# EAGLE design piZero_node_new (EAGLE 7.6.0)
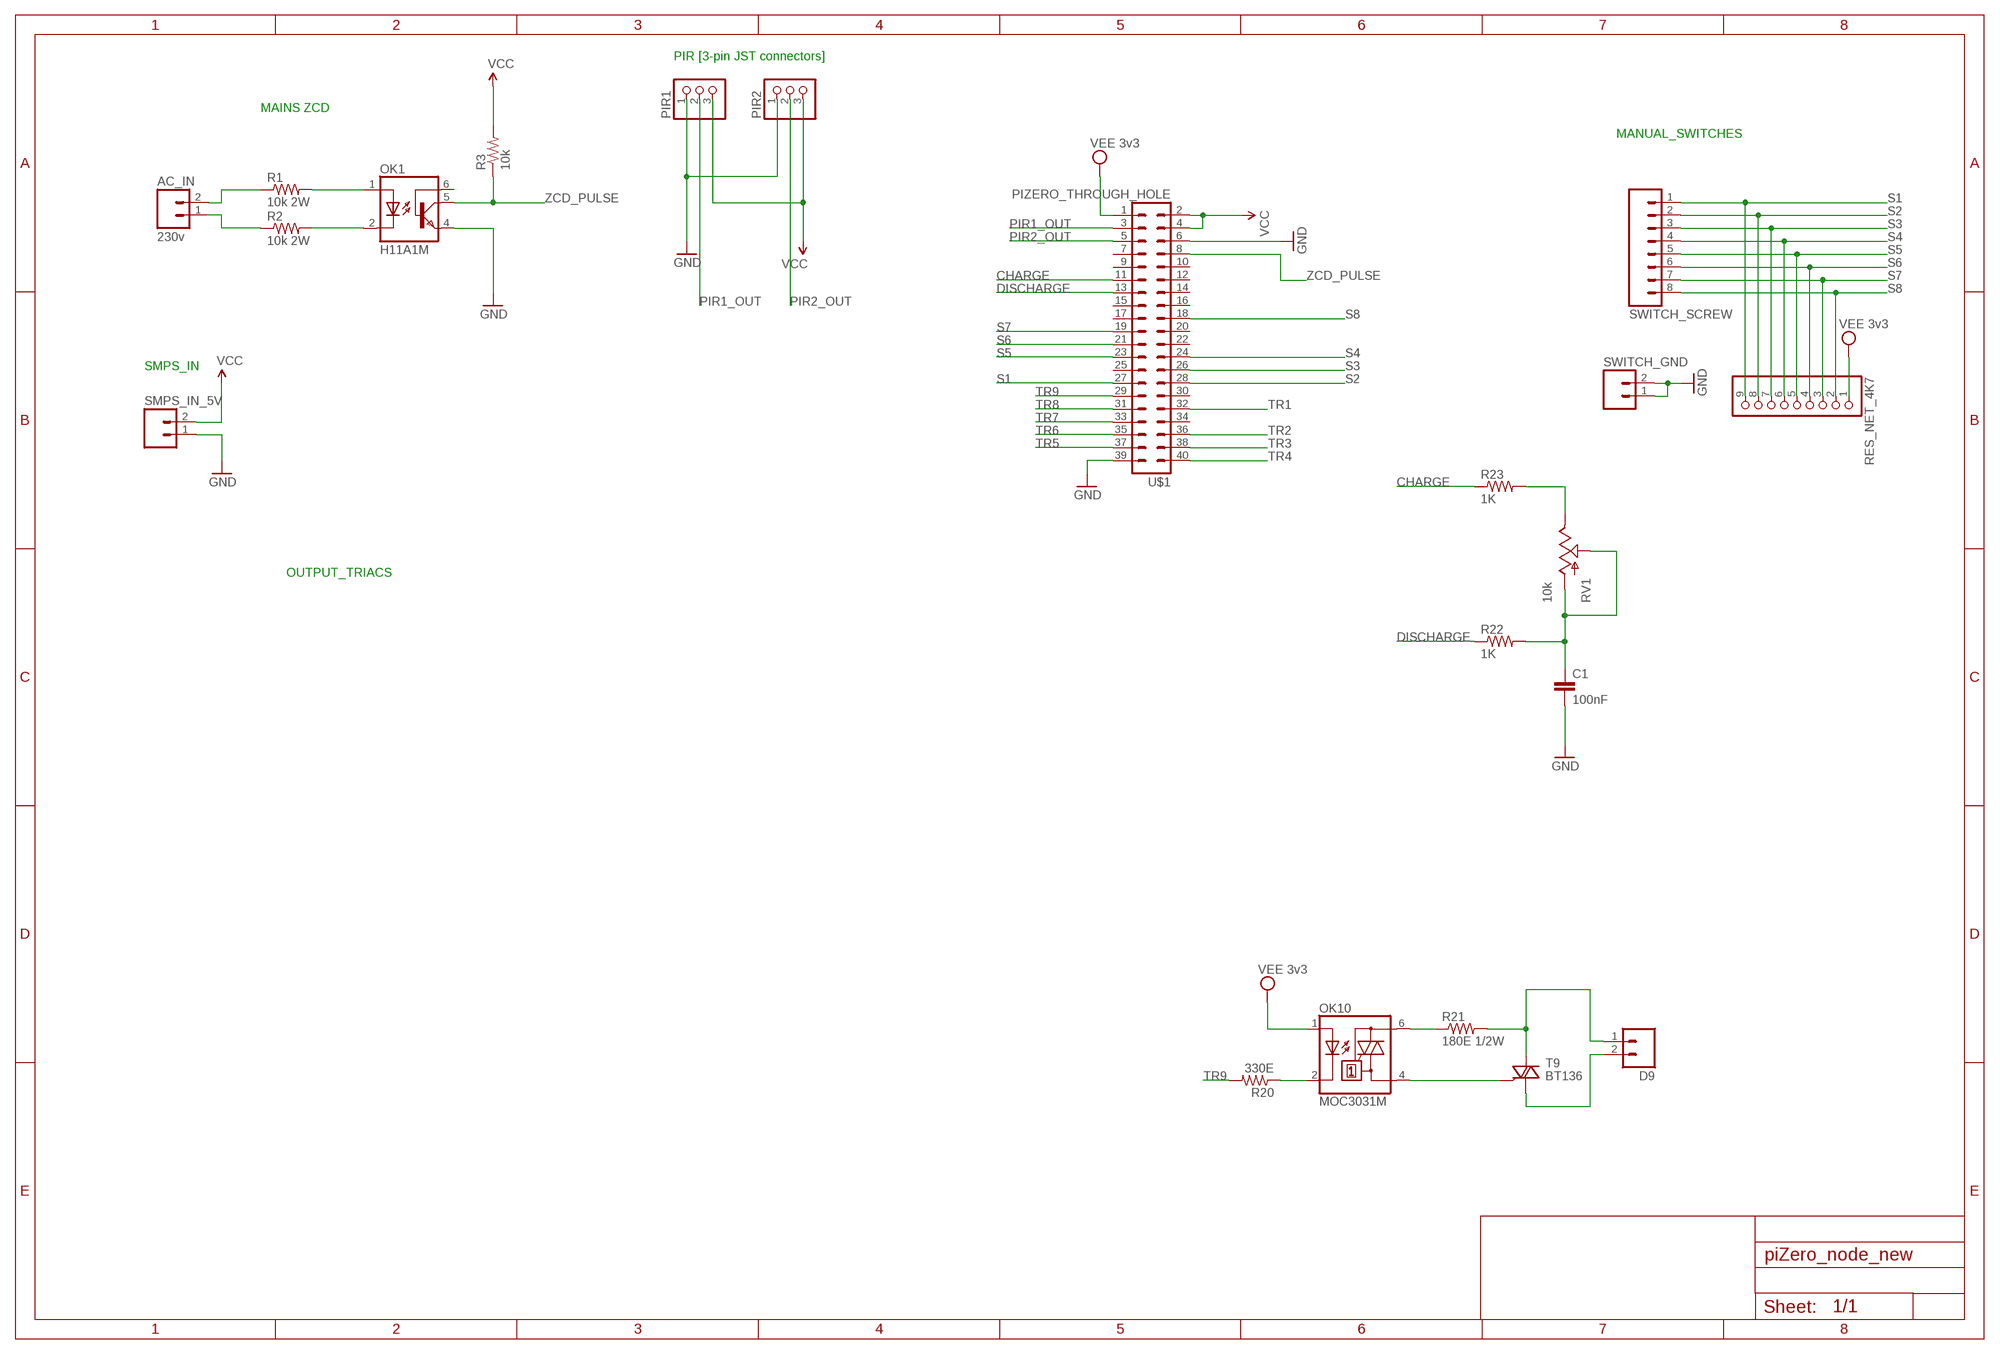
[diagram p0: schematic, sheet 1]

## Parts
AC_IN  230v  M023.5MM_LOCK  [SCREWTERMINAL-3.5MM-2_LOCK]
C1  100nF  C-EU025-025X050  [C025-025X050]
D9  M023.5MM_LOCK  [SCREWTERMINAL-3.5MM-2_LOCK]
OK1  H11A1M  [DIL06]
OK10  MOC3031M  [DIL06]
PIR1  PINHD-1X3  [1X03]
PIR2  PINHD-1X3  [1X03]
R1  10k 2W  RESISTORPTH-2W  [AXIAL-0.8]
R2  10k 2W  RESISTORPTH-2W  [AXIAL-0.8]
R3  10k  RESISTORPTH-1/4W  [AXIAL-0.4]
R20  330E  RESISTORPTH-1/4W  [AXIAL-0.4]
R21  180E 1/2W  RESISTORPTH-1/2W  [AXIAL-0.5]
R22  1K  RESISTORPTH-1/4W  [AXIAL-0.4]
R23  1K  RESISTORPTH-1/4W  [AXIAL-0.4]
RES_NET_4K7  PINHD-1X9  [1X09]
RV1  10k  POT-RV16AF-20  [POT_ALPHA_RV16AF-20]
SMPS_IN_5V  M023.5MM_LOCK  [SCREWTERMINAL-3.5MM-2_LOCK]
SWITCH_GND  M023.5MM  [SCREWTERMINAL-3.5MM-2]
SWITCH_SCREW  M083.5MM-8  [SCREWTERMINAL-3.5MM-8]
T9  BT136  [TO220AB]
U$1  PIZERO_THROUGH_HOLE  [PIZERO_THOUGH_HOLE]

## Nets
CHARGE: R23.P$1 U$1.11
DISCHARGE: R22.P$1 U$1.13
GND: C1.2 OK1.4(EMI) PIR1.1 PIR2.1 SMPS_IN_5V.1 SWITCH_GND.1 SWITCH_GND.2 U$1.6 U$1.39
N$1: AC_IN.2 R1.P$1
N$2: AC_IN.1 R2.P$1
N$3: OK1.1(A) R1.P$2
N$4: OK1.2(C) R2.P$2
N$45: OK10.6(A2) R21.P$1
N$46: D9.1 R21.P$2 T9.2(A2)
N$47: OK10.4(A1) T9.3(G)
N$48: D9.2 T9.1(A1)
N$49: OK10.2(C) R20.P$1
N$50: C1.1 R22.P$2 RV1.1(A) RV1.2(S)
N$52: R23.P$2 RV1.3(E)
PIR1_OUT: PIR1.2 U$1.3
PIR2_OUT: PIR2.2 U$1.5
S1: RES_NET_4K7.9 SWITCH_SCREW.1 U$1.27
S2: RES_NET_4K7.8 SWITCH_SCREW.2 U$1.28
S3: RES_NET_4K7.7 SWITCH_SCREW.3 U$1.26
S4: RES_NET_4K7.6 SWITCH_SCREW.4 U$1.24
S5: RES_NET_4K7.5 SWITCH_SCREW.5 U$1.23
S6: RES_NET_4K7.4 SWITCH_SCREW.6 U$1.21
S7: RES_NET_4K7.3 SWITCH_SCREW.7 U$1.19
S8: RES_NET_4K7.2 SWITCH_SCREW.8 U$1.18
TR1: U$1.32
TR2: U$1.36
TR3: U$1.38
TR4: U$1.40
TR5: U$1.37
TR6: U$1.35
TR7: U$1.33
TR8: U$1.31
TR9: R20.P$2 U$1.29
VCC: PIR1.3 PIR2.3 R3.P$2 SMPS_IN_5V.2 U$1.2 U$1.4
VEE: OK10.1(A) RES_NET_4K7.1 U$1.1 ; supply symbol labelled VEE 3v3
ZCD_PULSE: OK1.5(COL) R3.P$1 U$1.8
Unconnected: OK1.6(BAS) U$1.7 U$1.9 U$1.10 U$1.12 U$1.14 U$1.15 U$1.16 U$1.17 U$1.20 U$1.22 U$1.25 U$1.30 U$1.34

## Notes on the sheet
- PIR [3-pin JST connectors]
- MAINS ZCD
- MANUAL_SWITCHES
- SMPS_IN
- OUTPUT_TRIACS

## Library data of the parts
AC_IN D9 SMPS_IN_5V SWITCH_GND = SparkFun-Connectors:M02: Standard 2-pin 0.1" header. Use with - straight break away headers ( PRT-00116) - right angle break away headers (PRT-00553) - swiss pins (PRT-00743) - machine pins (PRT-00117) - female headers (PRT-00115) Molex polarized connector foot print use with: PRT-08233 with associated crimp pins and housings. 2.54_SCREWTERM for use with PRT-10571. 3.5mm Screw Terminal footprints for PRT-08084 5mm Screw Terminal footprints for use with PRT-08432; PROD_ID: CONN-08399
C1 = resistor:C-EU: CAPACITOR, European symbol
OK1 = optocoupler:H11A*?M: General Purpose 6-Pin Phototransistor Optocouplers Source: http://www.fairchildsemi.com/ds/4N/4N35-M.pdf; MPN: H11A1-M; OC_FARNELL: 1021358; OC_NEWARK: 97K1793
OK10 = optocoupler:MOC30*: 6-Pin DIP Zero-Cross Optoisolators Triac Driver Output (250/400 Volt Peak) Source: Data sheet <http://www.fairchildsemi.com/ds/MO/MOC3031M.pdf> The old path of data sheet not more available 2013-05-06.; MF: FAIRCHILD SEMICONDUCTOR; MPN: MOC3031M; OC_FARNELL: 9875964; OC_NEWARK: 78K6089
PIR1 PIR2 = pinhead:PINHD-1X3: PIN HEADER
R1-R3 R20-R23 = SparkFun-Passives:RESISTOR: Resistor Basic schematic elements and footprints for 0603, 1206, and PTH resistors.
RES_NET_4K7 = pinhead:PINHD-1X9: PIN HEADER
RV1 = SparkFun-Electromechanical:POT
SWITCH_SCREW = SparkFun-Connectors:M08: Header 8 Standard 8-pin 0.1" header. Use with straight break away headers (SKU : PRT-00116), right angle break away headers (PRT-00553), swiss pins (PRT-00743), machine pins (PRT-00117), and female headers (PRT-00115).
T9 = triac:BT136: Triac BT136 series E sensitive gate Source: http://www.nxp.com/acrobat_download/datasheets/BT136_SERIES_E_2.pdf
U$1 = pizero:PIZERO_THROUGH_HOLE

## Board
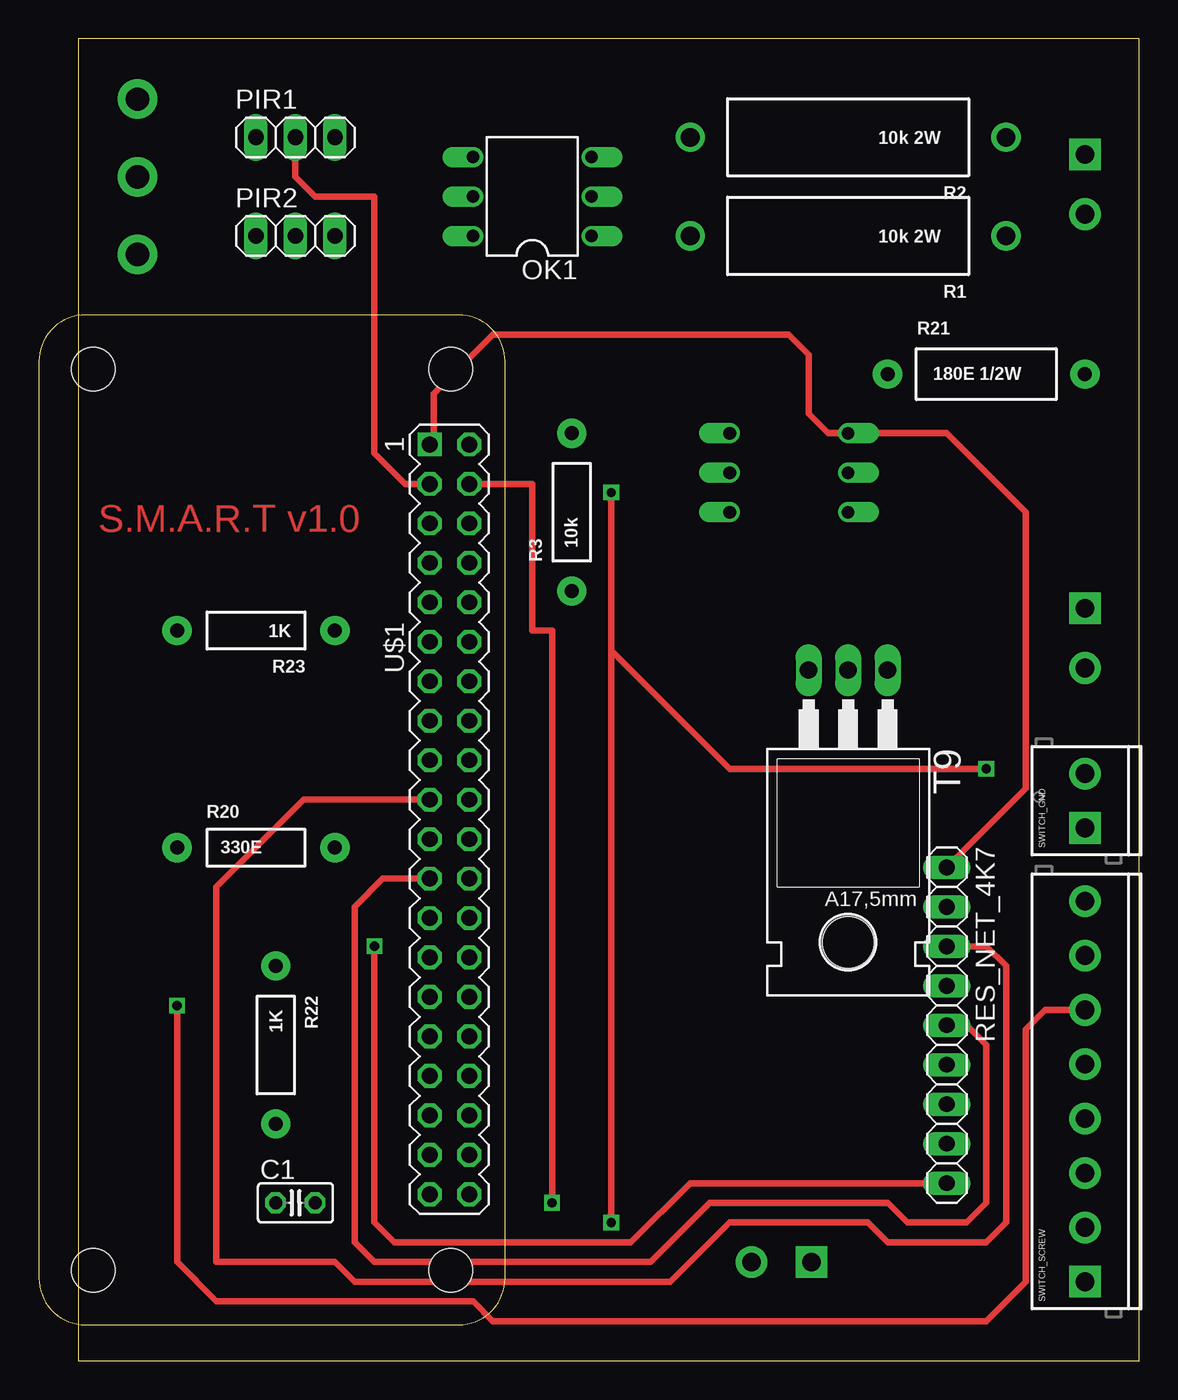
[diagram p1: board, top side]
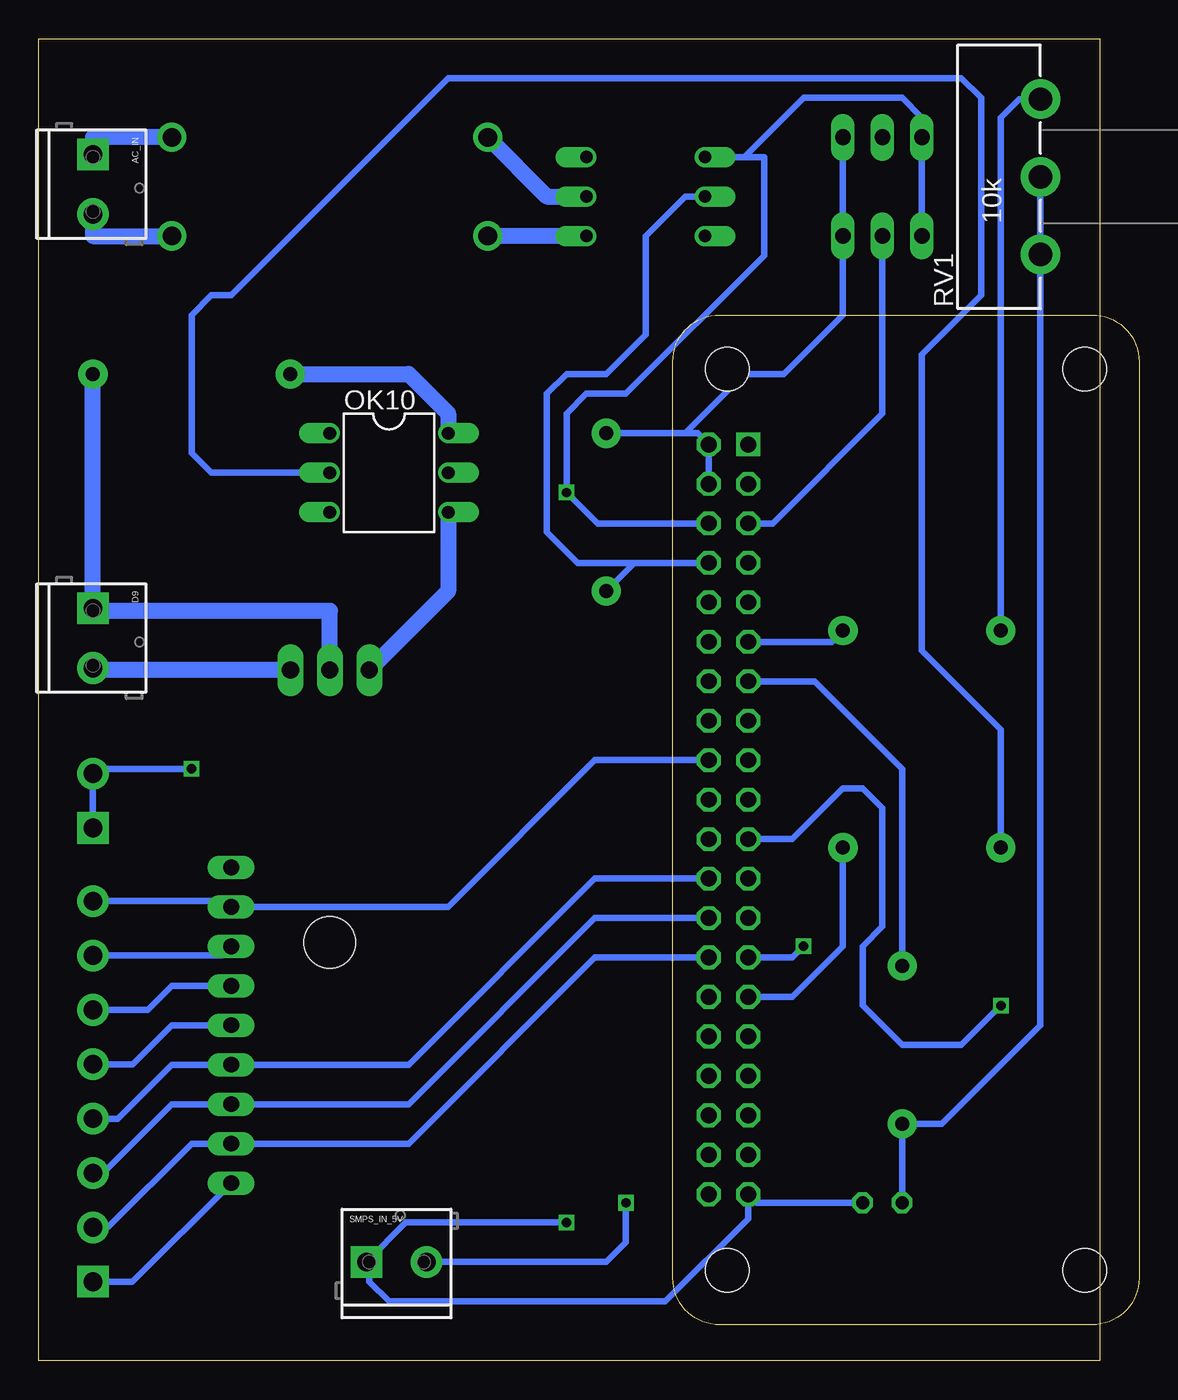
[diagram p2: board, bottom side, seen from below]

Size 68.25 x 85.08 mm. Coordinates in mm from the lower left corner, seen from the top.
Outline: 0,0 68.25,0 68.25,85.08 0,85.08 0,0
Copper layers (1*16): Top 0.035mm / dielectric 1.5mm / Bottom 0.035mm
Design rules "default": minimum track width 10mil, minimum drill 24mil, track to track 8mil, track to pad 8mil, pad to pad 8mil, via to via 8mil, smd to smd 8mil, copper to edge 40mil, drill to drill 8mil, minimum pad ring 10mil, minimum via ring 8mil, stop-mask expansion 4mil, vias tented up to drill 0mil, thermal gap 10mil

### Footprints (pad centres in the part's own frame; a part is rotated, then mirrored left to right if it is on the bottom)
SCREWTERMINAL-3.5MM-2_LOCK = drill 1.2 pad 2.032 square: 1 -0.178,0 | drill 1.2 pad 2.032: 2 3.678,0
C025-025X050 = drill 0.813 octagon: 1 -1.27,0; 2 1.27,0
DIL06 = drill 0.813 offset: 1 -2.54,-3.81; 2 0,-3.81; 3 2.54,-3.81; 4 2.54,3.81; 5 0,3.81; 6 -2.54,3.81
1X03 = drill 1.016 long: 1 -2.54,0; 2 0,0; 3 2.54,0
AXIAL-0.8 = drill 1.2 pad 1.88: P$1 -10.16,0; P$2 10.16,0
AXIAL-0.4 = drill 0.9 pad 1.88: P$1 -5.08,0; P$2 5.08,0
AXIAL-0.5 = drill 0.9 pad 1.88: P$1 -6.35,0; P$2 6.35,0
1X09 = drill 1.016 long: 1 -10.16,0; 2 -7.62,0; 3 -5.08,0; 4 -2.54,0; 5 0,0; 6 2.54,0; 7 5.08,0; 8 7.62,0; 9 10.16,0
POT_ALPHA_RV16AF-20 = drill 1.5 pad 2.54: 1 -5,0; 2 0,0; 3 5,0
SCREWTERMINAL-3.5MM-2 = drill 1.2 pad 2.032 square: 1 0,0 | drill 1.2 pad 2.032: 2 3.5,0
SCREWTERMINAL-3.5MM-8 = drill 1.2 pad 2.032 square: 1 0,0 | drill 1.2 pad 2.032: 2 3.5,0; 3 7,0; 4 10.5,0; 5 14,0; 6 17.5,0; 7 21,0; 8 24.5,0
TO220AB = drill 1.118 long: 1 -2.54,-6.35; 2 0,-6.35; 3 2.54,-6.35 | hole 3.302: 0,11.176
PIZERO_THOUGH_HOLE = drill 1.016 square: 1 8.34,25.15 | drill 1.016 octagon: 2 8.34,27.69; 3 10.88,25.15; 4 10.88,27.69; 5 13.42,25.15; 6 13.42,27.69; 7 15.96,25.15; 8 15.96,27.69; 9 18.5,25.15; 10 18.5,27.69; 11 21.04,25.15; 12 21.04,27.69; 13 23.58,25.15; 14 23.58,27.69; 15 26.12,25.15; 16 26.12,27.69; 17 28.66,25.15; 18 28.66,27.69; 19 31.2,25.15; 20 31.2,27.69; 21 33.74,25.15; 22 33.74,27.69; 23 36.28,25.15; 24 36.28,27.69; 25 38.82,25.15; 26 38.82,27.69; 27 41.36,25.15; 28 41.36,27.69; 29 43.9,25.15; 30 43.9,27.69; 31 46.44,25.15; 32 46.44,27.69; 33 48.98,25.15; 34 48.98,27.69; 35 51.52,25.15; 36 51.52,27.69; 37 54.06,25.15; 38 54.06,27.69; 39 56.6,25.15; 40 56.6,27.69 | hole 2.8: 3.5,3.5; 3.5,26.5; 61.5,26.5; 61.5,3.5

### Placement (x,y rotation side)
AC_IN  64.77,77.47 270 bottom
C1  13.97,10.16 0 top
D9  64.77,48.26 270 bottom
OK1  29.21,74.93 90 top
OK10  45.72,57.15 270 bottom
PIR1  13.97,78.74 0 top
PIR2  13.97,72.39 0 top
R1  49.53,72.39 180 top
R2  49.53,78.74 180 top
R3  31.75,54.61 90 top
R20  11.43,33.02 0 top
R21  58.42,63.5 0 top
R22  12.7,20.32 270 top
R23  11.43,46.99 180 top
RES_NET_4K7  55.88,21.59 270 top
RV1  3.81,76.2 90 bottom
SMPS_IN_5V  46.99,6.35 0 bottom
SWITCH_GND  64.77,34.29 90 top
SWITCH_SCREW  64.77,5.08 90 top
T9  49.53,38.1 180 top
U$1  -2.54,67.31 270 top

### Tracks (layer width: path | path; a pad name or v marks a point on that pad's centre or on a via)
CHARGE
  Bottom 0.406: R23.P$1 17.23,46.27 U$1.11
DISCHARGE
  Bottom 0.406: U$1.13 18.33,43.73 12.7,38.1 R22.P$1
GND  (via drill 0.6)
  Top 0.406: v58.42,38.1 41.91,38.1 34.29,45.72 | 34.29,45.72 v34.29,55.88 | v34.29,8.89 34.29,45.72
  Bottom 0.406: OK1.4 22.86,77.47 | 22.86,77.47 19.05,81.28 12.7,81.28 11.43,80.01 PIR1.1 PIR2.1 | U$1.6 32.3,53.89 v34.29,55.88 34.29,60.96 33.02,62.23 30.48,62.23 21.59,71.12 21.59,77.47 22.86,77.47 | SWITCH_GND.1 SWITCH_GND.2 64.46,38.1 v58.42,38.1 | C1.2 22.06,10.16 U$1.39 22.61,9.14 27.94,3.81 45.72,3.81 46.99,5.08 46.99,6.17 SMPS_IN_5V.1 44.63,8.89 v34.29,8.89
N$1
  Bottom 1.016: AC_IN.2 64.77,72.39 R1.P$1
N$2
  Bottom 1.016: R2.P$1 64.77,78.74 AC_IN.1
N$3
  Bottom 1.016: OK1.1 R1.P$2
N$4
  Bottom 1.016: R2.P$2 35.56,74.93 OK1.2
N$45
  Bottom 1.016: R21.P$1 44.45,63.5 41.91,60.96 OK10.6
N$46
  Bottom 1.016: R21.P$2 D9.1 64.59,48.26 49.53,48.26 T9.2
N$47
  Bottom 1.016: OK10.4 41.91,49.53 T9.3
N$48
  Bottom 1.016: T9.1 64.64,44.45 D9.2
N$49
  Bottom 0.406: R20.P$1 6.35,40.64 11.43,45.72 11.43,64.77 7.62,68.58 7.62,81.28 8.89,82.55 41.91,82.55 55.88,68.58 57.15,68.58 58.42,67.31 58.42,58.42 57.15,57.15 OK10.2
N$50
  Bottom 0.406: C1.1 R22.P$2 10.16,15.24 3.81,21.59 RV1.1 RV1.2
N$52
  Bottom 0.406: RV1.3 5.16,81.2 6.35,80.01 R23.P$2
PIR1_OUT
  Top 0.406: U$1.3 21.04,56.43 19.05,58.42 19.05,74.93 15.24,74.93 13.97,76.2 PIR1.2
PIR2_OUT
  Bottom 0.406: PIR2.2 13.97,60.96 21.04,53.89 U$1.5
S1  (via drill 0.6)
  Top 0.406: v19.05,26.67 19.05,8.89 20.32,7.62 35.56,7.62 39.37,11.43 RES_NET_4K7.9
  Bottom 0.406: RES_NET_4K7.9 62.23,5.08 SWITCH_SCREW.1 | U$1.27 19.77,25.95 v19.05,26.67
S2
  Bottom 0.406: SWITCH_SCREW.2 63.81,8.58 58.42,13.97 RES_NET_4K7.8 44.45,13.97 32.47,25.95 U$1.28
S3
  Bottom 0.406: SWITCH_SCREW.3 64.12,12.08 59.69,16.51 RES_NET_4K7.7 44.45,16.51 32.47,28.49 U$1.26
S4
  Bottom 0.406: SWITCH_SCREW.4 63.16,15.58 59.69,19.05 RES_NET_4K7.6 44.45,19.05 32.47,31.03 U$1.24
S5
  Top 0.406: U$1.23 19.6,31.03 17.78,29.21 17.78,7.62 19.05,6.35 36.83,6.35 40.64,10.16 52.07,10.16 53.34,8.89 57.15,8.89 58.42,10.16 58.42,20.32 57.15,21.59 RES_NET_4K7.5
  Bottom 0.406: RES_NET_4K7.5 59.69,21.59 62.2,19.08 SWITCH_SCREW.5
S6  (via drill 0.6)
  Top 0.406: v6.35,22.86 6.35,6.35 8.89,3.81 25.4,3.81 26.67,2.54 58.42,2.54 60.96,5.08 60.96,21.31 62.23,22.58 SWITCH_SCREW.6
  Bottom 0.406: RES_NET_4K7.4 59.69,24.13 61.24,22.58 SWITCH_SCREW.6 | U$1.21 19.77,33.57 16.51,36.83 15.24,36.83 13.97,35.56 13.97,27.94 15.24,26.67 15.24,22.86 12.7,20.32 8.89,20.32 v6.35,22.86
S7
  Top 0.406: 20.87,36.11 U$1.19 14.52,36.11 8.89,30.48 8.89,6.35 16.51,6.35 17.78,5.08 38.1,5.08 41.91,8.89 50.8,8.89 52.07,7.62 58.42,7.62 59.69,8.89 59.69,25.4 58.42,26.67 RES_NET_4K7.3
  Bottom 0.406: RES_NET_4K7.3 56.47,26.08 SWITCH_SCREW.7
S8
  Bottom 0.406: SWITCH_SCREW.8 56.25,29.58 RES_NET_4K7.2 41.91,29.21 32.47,38.65 U$1.18
TR9
  Bottom 0.406: U$1.29 19.77,23.41 16.51,26.67 R20.P$2
VCC  (via drill 0.6)
  Top 0.406: U$1.4 29.21,56.43 29.21,46.99 30.48,46.99 v30.48,10.16
  Bottom 0.406: R3.P$2 26.67,59.69 | 26.67,59.69 25.87,59.69 U$1.2 U$1.4 | PIR1.3 PIR2.3 16.51,67.31 20.32,63.5 22.86,63.5 26.67,59.69 | v30.48,10.16 30.48,7.62 31.75,6.35 SMPS_IN_5V.2
VEE
  Top 0.406: U$1.1 22.86,59.22 22.86,62.23 26.67,66.04 45.72,66.04 46.99,64.77 46.99,60.96 48.26,59.69 OK10.1 55.88,59.69 60.96,54.61 60.96,36.83 RES_NET_4K7.1
ZCD_PULSE
  Bottom 0.406: U$1.8 29.93,51.35 | 29.93,51.35 R3.P$1 | OK1.5 26.67,74.93 29.21,72.39 29.21,66.04 31.75,63.5 34.29,63.5 35.56,62.23 35.56,53.34 33.57,51.35 29.93,51.35

### Text on the board
Top: S.M.A.R.T v1.0